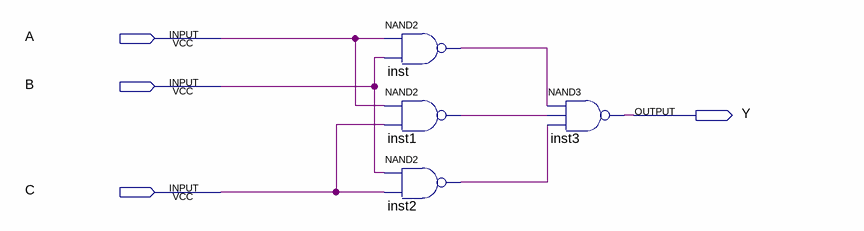
[diagram p0: schematic sheet]
// Quartus schematic chooser3.bdf as structural Verilog: 4 symbols, 4 pins
module chooser3 (
  input  A,
  input  B,
  input  C,
  output Y
);

  wire inst1_out, inst2_out, inst_out;

  nand inst (inst_out, A, B);
  nand inst1 (inst1_out, A, C);
  nand inst2 (inst2_out, B, C);
  nand inst3 (Y, inst_out, inst1_out, inst2_out);
endmodule
